# Altium schematic sheet AD9777(2).SchDoc
size 420 x 297 mm
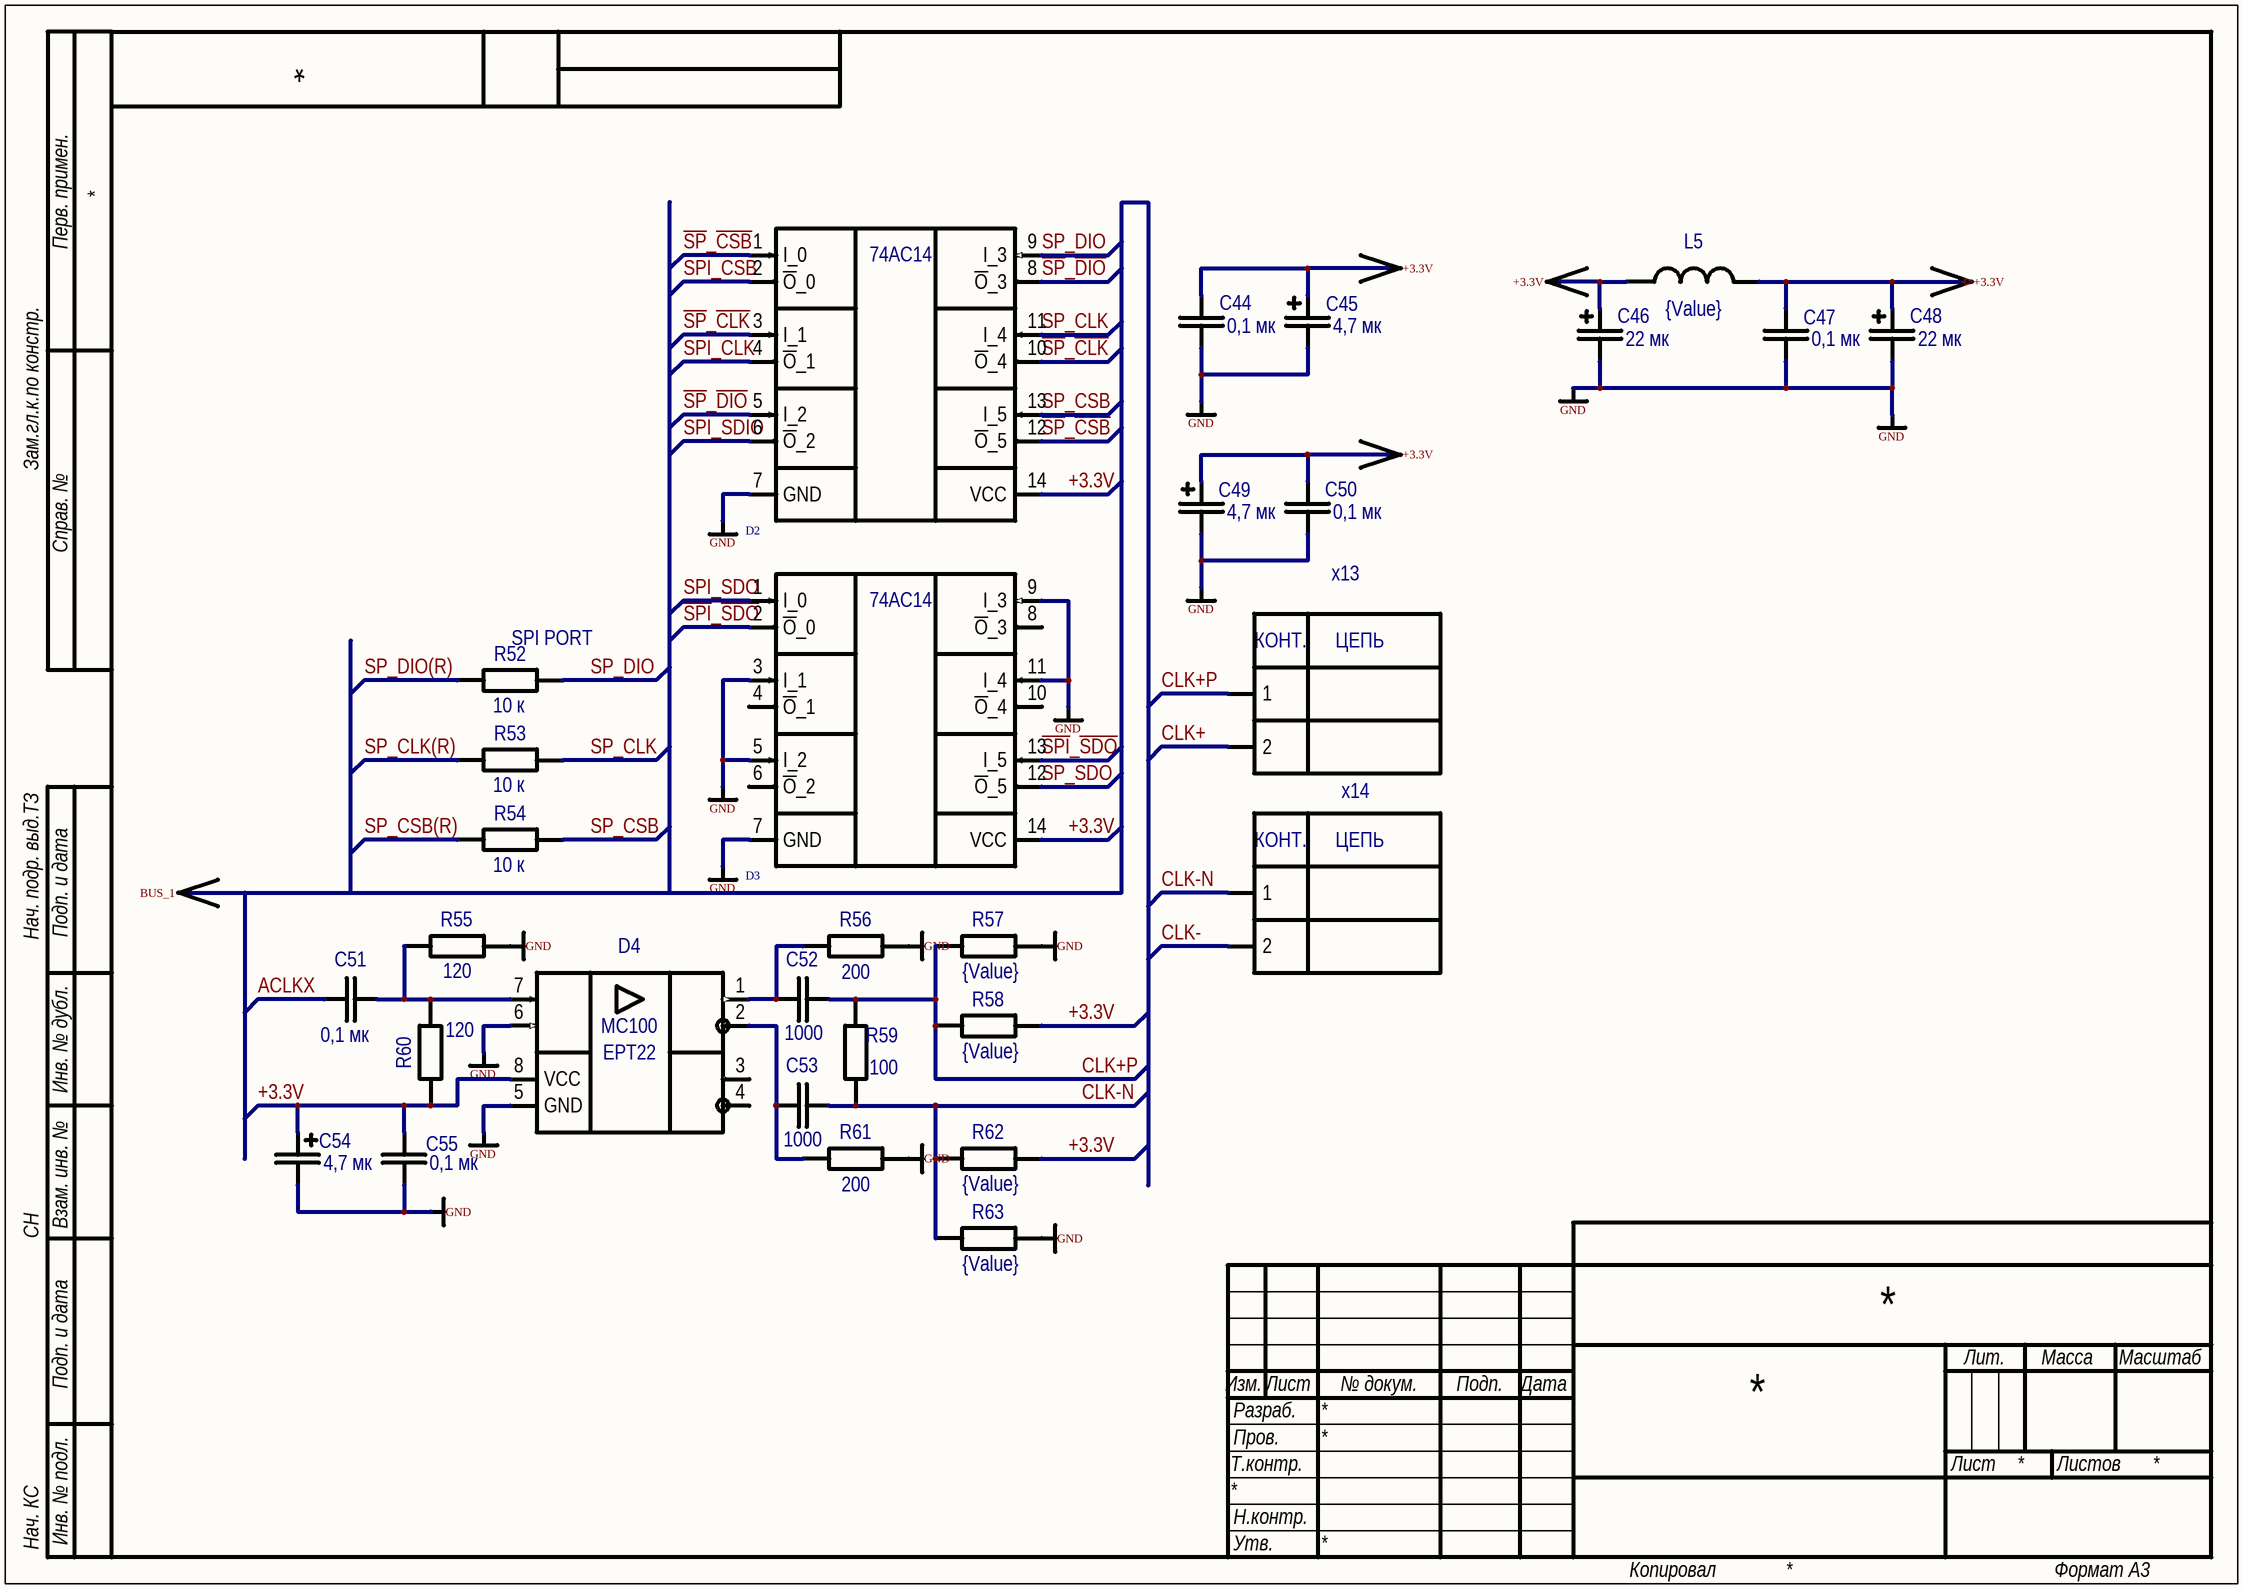
[diagram p0: AD9777(2).SchDoc]

## Parts
(Parts that share a designator on the sheet are numbered #1, #2 ... from top to bottom, then left to right.)
*?#1  VCC  (value not drawn)  (graphical)
*?#2  VCC  (value not drawn)  (graphical)
*?#3  VCC  (value not drawn)  (graphical)
*?#4  GND  (value not drawn)  (graphical)
*?#5  GND  (value not drawn)  (graphical)
*?#6  GND  (value not drawn)  (graphical)
*?#7  VCC  (value not drawn)  (graphical)
*?#8  GND  (value not drawn)  (graphical)
*?#9  GND  (value not drawn)  (graphical)
*?#10  GND  (value not drawn)  (graphical)
*?#11  GND  (value not drawn)  (graphical)
*?#12  GND  (value not drawn)  (graphical)
*?#13  VCC  (value not drawn)  (graphical)
*?#14  GND  (value not drawn)  (graphical)
*?#15  GND  (value not drawn)  (graphical)
*?#16  GND  (value not drawn)  (graphical)
*?#17  GND  (value not drawn)  (graphical)
*?#18  GND  (value not drawn)  (graphical)
*?#19  GND  (value not drawn)  (graphical)
*?#20  GND  (value not drawn)  (graphical)
*?#21  GND  (value not drawn)  (graphical)
C44  0,1 мк  [CAPC2012L]
C45  4,7 мк  [TC3216-1206]
C46  22 мк  [TC3528-1411]
C47  0,1 мк  [CAPC2012L]
C48  22 мк  [TC3528-1411]
C49  4,7 мк  [TC3216-1206]
C50  0,1 мк  [CAPC2012L]
C51  0,1 мк  [CAPC2012L]
C52  1000  [CAPC1608L]
C53  1000  [CAPC1608L]
C54  4,7 мк  [TC3216-1206]
C55  0,1 мк  [CAPC2012L]
D2  74AC14  [SOIC127P600X175-14N]  (value not drawn)
D3  74AC14  [SOIC127P600X175-14N]  (value not drawn)
D4  MC100EPT22  [TSSOP50P490X110-10N]  (value not drawn)
L5  {Value}  [INDC3225L]
R52  10 к  [RESC1608L]
R53  10 к  [RESC1608L]
R54  10 к  [RESC1608L]
R55  120  [RESC1608L]
R56  200  [RESC2012L]
R57  {Value}  [RESC2012L]
R58  {Value}  [RESC2012L]
R59  100  [RESC1608L]
R60  120  [RESC1608L]
R61  200  [RESC2012L]
R62  {Value}  [RESC2012L]
R63  {Value}  [RESC2012L]
x13  PLD2  [PLD-2]  (value not drawn)
x14  PLD2  [PLD-2]  (value not drawn)

## Nets
+3.3V: C44.2 C45.2 C46.2 C47.2 C48.2 C49.2 C50.2 C54.2 C55.2 D2.14(VCC) D3.14(VCC) D4.8(VCC) L5.1 L5.2 R58.2 R60.1 R62.2
GND: C44.1 C45.1 C46.1 C47.1 C48.1 C49.1 C50.1 C54.1 C55.1 D2.7(GND) D3.3(I_1) D3.5(I_2) D3.7(GND) D3.9(I_3) D3.11(I_4) D4.5(GND) D4.6(D_1) R55.2 R56.2 R57.2 R61.2 R63.2
ACLKX: C51.1
CLK+: x13.2
CLK+P: C52.2 R57.1 R58.1 R59.2 x13.1
CLK-: x14.2
CLK-N: C53.2 R59.1 R62.1 R63.1 x14.1
~{SP}_~{CLK}: D2.3(I_1) D2.10(~{O}_4)
~{SP}_~{CSB}: D2.1(I_0) D2.12(~{O}_5)
~{SP}_~{DIO}: D2.5(I_2) D2.8(~{O}_3)
~{SPI}_~{SDO}: D3.2(~{O}_0) D3.13(I_5)
SP_CLK: D2.11(I_4) R53.2
SP_CLK(R): R53.1
SP_CSB: D2.13(I_5) R54.2
SP_CSB(R): R54.1
SP_DIO: D2.9(I_3) R52.2
SP_DIO(R): R52.1
SP_SDO: D3.12(~{O}_5)
SPI_CLK: D2.4(~{O}_1)
SPI_CSB: D2.2(~{O}_0)
SPI_SDIO: D2.6(~{O}_2)
SPI_SDO: D3.1(I_0)
NetC51_2: C51.2 D4.7(D_0) R55.1 R60.2
NetC52_1: C52.1 D4.1(Q_0) R56.1
NetC53_1: C53.1 D4.2(~{Q}_0) R61.1

Not connected (* = marked no-connect by the designer): D3 4(~{O}_1) 6(~{O}_2) 8(~{O}_3) 10(~{O}_4); D4 3(Q_1) 4(~{Q}_1)

## Notes on the sheet
- (near R52) SPI PORT
- Labels drawn without touching a wire or pin: BUS_1
- Перв. примен.
- Зам.гл.к.по констр.
- Справ. №
- Нач. подр. выд.ТЗ
- Подп. и дата
- Инв. № дубл.
- Взам. инв. №
- СН
- Изм.
- Лист
- № докум.
- Подп.
- Дата
- Лит.
- Масса
- Масштаб
- Т.контр.
- Пров.
- Разраб.
- Листов
- Нач. КС
- Инв. № подл.
- Н.контр.
- Утв.
- Копировал
- Формат А3
- (in symbol MC100EPT22) MC100; EPT22
- (in symbol PLD2) КОНТ.; ЦЕПЬ

## Library data of the parts
*?#1-*?#3 *?#7 *?#13 = VCC: Порт ЕСКД. Для "наложения" на штатный Power Bar
*?#4-*?#6 *?#8-*?#12 *?#14-*?#21 = GND: Корпус ЕСКД. Для "наложения" на штатный Power Bar
C44 C47 C50 C51 C55 = i6124B5A0870C4000003: Чип-конденсатор; ManufacturerPartNumber: 0805 X7R 0,1 мкФ ±10 % 50 В; Name: 0805; Power/Voltage: 50 В; TKE/TKC: {TKE/TKC}; Tolerance: ±10 %; PCADSymbol: C; PCADLibrary: PASSIV.LIB; BCPId: *; Manufacturer: *; Type: Конденсатор; Value: 0,1 мк; ImKey: i6124B5A0870C4000003; PCADType: C0805; PCADPattern: C0805
C45 C49 C54 = i6124B5A087028000009: Танталовый конденсатор; ManufacturerPartNumber: TAJA475M025RNJ (4,7 мкФ ±20 % 25 В); Power/Voltage: 25 В; Tolerance: ±20 %; PCADSymbol: TAJ; PCADLibrary: PASSIV.LIB; BCPId: *; Manufacturer: *; Name: TAJA; TKE/TKC: *; Type: Конденсатор; Value: 4,7 мк; ImKey: i6124B5A087028000009; PCADType: TAJA; PCADPattern: TAJA
C46 C48 = i6124B5A087041000004: Танталовый конденсатор; ManufacturerPartNumber: TAJB226M020RNJ (22 мкФ ±20 % 20 В); Power/Voltage: 20 В; Tolerance: ±20 %; PCADSymbol: TAJ; PCADLibrary: PASSIV.LIB; BCPId: *; Manufacturer: *; Name: TAJB; TKE/TKC: *; Type: Конденсатор; Value: 22 мк; ImKey: i6124B5A087041000004; PCADType: TAJB; PCADPattern: TAJB
C52 C53 = i6124B5A08701E000003: Чип-конденсатор; ManufacturerPartNumber: 0603 X7R 1000 пФ ±10 % 50 В; Name: 0603; Power/Voltage: 50 В; TKE/TKC: {TKE/TKC}; Tolerance: ±10 %; PCADSymbol: C; PCADLibrary: PASSIV.LIB; BCPId: *; Manufacturer: *; Type: Конденсатор; Value: 1000; ImKey: i6124B5A08701E000003; PCADType: C0603; PCADPattern: C0603
D2 D3 = 74AC14: Hex Inverter Schmitt  Trigger; Manufacturer: Fairchild Semiconductor; Type: Микросхема; ManufacturerPartNumber: 74AC14; Package: SOIC
D4 = MC100EPT22: 3.3V Dual LVTTL/LVCMOS to Differential LVPECL Translator; Manufacturer: On Semiconductor; Type: Микросхема; BCPId: *; Name: *; Package: TSSOP-8; ManufacturerPartNumber: MC100EPT22
L5 = L1210: Индуктивность без магнитопровода; Name: 1210; Tolerance: {Tolerance}; BCPId: *; Manufacturer: *; Package: *; ManufacturerPartNumber: *; Type: Индуктивность; Value: {Value}
R52-R54 = i6124B5A08707A000001: Чип-резистор; ManufacturerPartNumber: Р1-12-0,1-10 кОм ±5 % - Т; Name: 0603; Tolerance: ±5 %; Power/Voltage: 0,1 Вт; TU/GOST: АЛЯР.434110.005 ТУ; BCPId: *; Manufacturer: *; Type: Резистор; Value: 10 к; ImKey: i6124B5A08707A000001
R55 R60 = i6124B5A08707A000041: Чип-резистор; ManufacturerPartNumber: Р1-12-0,1-120 Ом ±5 % - Т; Name: 0603; Tolerance: ±5 %; Power/Voltage: 0,1 Вт; TU/GOST: АЛЯР.434110.005 ТУ; BCPId: *; Manufacturer: *; Type: Резистор; Value: 120; ImKey: i6124B5A08707A000041
R56 R61 = i6124B5A0870A7000031: Чип-резистор; ManufacturerPartNumber: Р1-12-0,125-200 Ом ±5 % - Т; Name: 0805; Tolerance: ±5 %; Power/Voltage: 0,125 Вт; TU/GOST: АЛЯР.434110.005 ТУ; BCPId: *; Manufacturer: *; Type: Резистор; Value: 200; ImKey: i6124B5A0870A7000031
R57 R58 R62 R63 = R0805: Чип-резистор; Name: 0805; Tolerance: {Tolerance}; BCPId: *; Manufacturer: *; ManufacturerPartNumber: *; Type: Резистор; Value: {Value}
R59 = i6124B5A08707A000021: Чип-резистор; ManufacturerPartNumber: Р1-12-0,1-100 Ом ±5 % - Т; Name: 0603; Tolerance: ±5 %; Power/Voltage: 0,1 Вт; TU/GOST: АЛЯР.434110.005 ТУ; BCPId: *; Manufacturer: *; Type: Резистор; Value: 100; ImKey: i6124B5A08707A000021
x13 x14 = PLD2: Штыри на плату, шаг 2.54мм.; BCPId: *; ManufacturerPartNumber: PLD2; Rem: *; Package: *; TU/GOST: *; Type: Вилка; HelpURL: *; Price: *